# Altium schematic sheet M_microcontrolador.SchDoc
size Legal
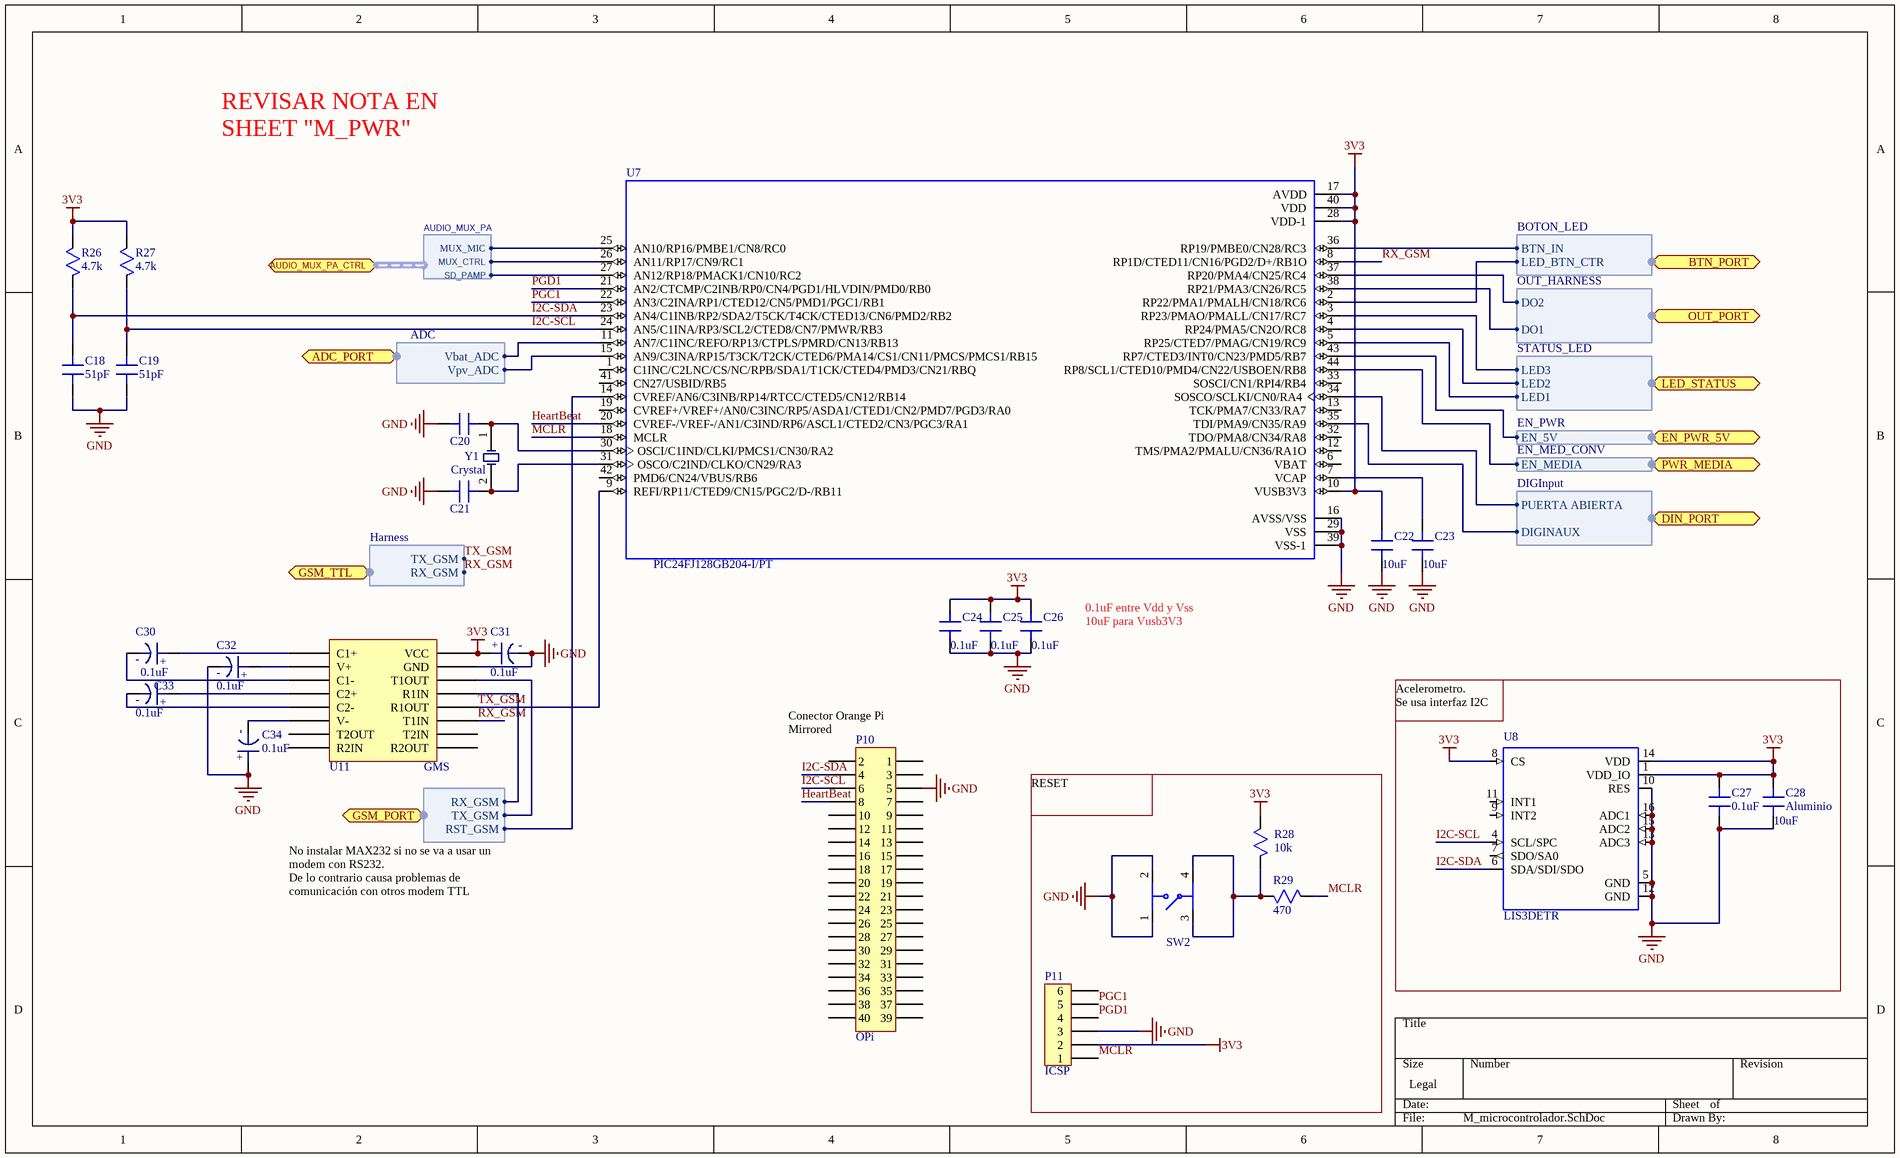
[diagram p0: M_microcontrolador.SchDoc]

## Parts
C18  51pF  [Capacitor0805]
C19  51pF  [Capacitor0805]
C20  CapacitorSMD  [Capacitor0805]  (value not drawn)
C21  CapacitorSMD  [Capacitor0805]  (value not drawn)
C22  value 10uF  [Capacitor0805]  (hidden comment: CapacitorSMD)
C23  value 10uF  [Capacitor0805]  (hidden comment: CapacitorSMD)
C24  value 0.1uF  [Capacitor0805]  (hidden comment: CapacitorSMD)
C25  value 0.1uF  [Capacitor0805]  (hidden comment: CapacitorSMD)
C26  value 0.1uF  [Capacitor0805]  (hidden comment: CapacitorSMD)
C27  value 0.1uF  [Capacitor0805]  (hidden comment: CapacitorSMD)
C28  Aluminio  value 10uF  [Capacitor0805]
C30  0.1uF  [CAPACITORE0805]
C31  0.1uF  [CAPACITORE0805]
C32  0.1uF  [CAPACITORE0805]
C33  0.1uF  [CAPACITORE0805]
C34  0.1uF  [CAPACITORE0805]
P10  OPi  [MALE2x20PIN]
P11  ICSP  [MALE6PIN]
R26  4.7k  [ResistorSMD0805]
R27  4.7k  [ResistorSMD0805]
R28  10k  [ResistorSMD0805]
R29  470  [ResistorSMD1206]
SW2  Tactile Switch  [TactileSwitch]  (value not drawn)
U7  PIC24FJ128GB204-I/PT  [QFP80P1200X1200X120-44N]
U8  LIS3DETR  [LGA16R50P5X3_300X300X100N]
U11  SP3232EBCN  [SP3232EBCN]  (value not drawn)
Y1  Crystal  [CRYSTALSMDMini]

## Ports
ADC_PORT (harness ADC), AUDIO_MUX_PA_CTRL (harness AUDIO_MUX_PA), BTN_PORT (harness BOTON_LED), DIN_PORT (harness DIGInput), EN_PWR_5V (harness EN_PWR), GSM_PORT (harness GMS), GSM_TTL (harness Harness), LED_STATUS (harness STATUS_LED), OUT_PORT (harness OUT_HARNESS), PWR_MEDIA (harness EN_MED_CONV)

## Harnesses
ADC: Vbat_ADC, Vpv_ADC
STATUS_LED: LED1, LED2, LED3
BOTON_LED: BTN_IN, LED_BTN_CTR
OUT_HARNESS: DO1, DO2
DIGInput: PUERTA ABIERTA, DIGINAUX
EN_PWR: EN_5V
EN_MED_CONV: EN_MEDIA
AUDIO_MUX_PA: SD_PAMP, MUX_CTRL, MUX_MIC
GMS: RST_GSM, RX_GSM, TX_GSM
Harness: RX_GSM, TX_GSM

## Nets
3V3: C22.2 C24.2 C25.2 C26.2 C27.2 C28.2 C31.1 P11.2 R26.2 R27.2 R28.2 U7.10(VUSB3V3) U7.17(AVDD) U7.28(VDD-1) U7.40(VDD) U8.1(VDD_IO) U8.8(CS) U8.14(VDD) U11.16(VCC)
GND: C18.2 C19.2 C20.1 C21.1 C22.1 C23.1 C24.1 C25.1 C26.1 C27.1 C28.1 C31.2 C32.2 C34.1 P10.5 P11.3 SW2.1 SW2.2 U7.16(AVSS/VSS) U7.29(VSS) U7.39(VSS-1) U8.5(GND) U8.10(RES) U8.12(GND) U8.13(ADC3) U8.15(ADC2) U8.16(ADC1) U11.15(GND)
HeartBeat: P10.8 U7.20(CVREF-/VREF-/AN1/C3IND/RP6/ASCL1/CTED2/CN3/PGC3/RA1)
I2C-SCL: C19.1 P10.6 R27.1 U7.24(AN5/C1INA/RP3/SCL2/CTED8/CN7/PMWR/RB3) U8.4(SCL/SPC)
I2C-SDA: C18.1 P10.4 R26.1 U7.23(AN4/C1INB/RP2/SDA2/T5CK/T4CK/CTED13/CN6/PMD2/RB2) U8.6(SDA/SDI/SDO)
MCLR: P11.1 R29.2 U7.18(MCLR)
PGC1: P11.5 U7.22(AN3/C2INA/RP1/CTED12/CN5/PMD1/PGC1/RB1)
PGD1: P11.4 U7.21(AN2/CTCMP/C2INB/RP0/CN4/PGD1/HLVDIN/PMD0/RB0)
RX_GSM: U7.8(RP1D/CTED11/CN16/PGD2/D+/RB1O) U11.11(T1IN) ; port GSM_TTL.RX_GSM
TX_GSM: U7.9(REFI/RP11/CTED9/CN15/PGC2/D-/RB11) U11.12(R1OUT) ; port GSM_TTL.TX_GSM
NetC20_2: C20.2 U7.30(OSCI/C1IND/CLKI/PMCS1/CN30/RA2) Y1.1
NetC21_2: C21.2 U7.31(OSCO/C2IND/CLKO/CN29/RA3) Y1.2
NetC23_2: C23.2 U7.7(VCAP)
NetC30_1: C30.1 U11.1(C1+)
NetC30_2: C30.2 U11.3(C1-)
NetC32_1: C32.1 U11.2(V+)
NetC33_1: C33.1 U11.4(C2+)
NetC33_2: C33.2 U11.5(C2-)
NetC34_2: C34.2 U11.6(V-)
NetR28_1: R28.1 R29.1 SW2.3 SW2.4
NetU7_2: U7.2(RP22/PMA1/PMALH/CN18/RC6) ; port BTN_PORT.LED_BTN_CTR
NetU7_3: U7.3(RP23/PMAO/PMALL/CN17/RC7) ; port LED_STATUS.LED3
NetU7_4: U7.4(RP24/PMA5/CN2O/RC8) ; port LED_STATUS.LED2
NetU7_5: U7.5(RP25/CTED7/PMAG/CN19/RC9) ; port LED_STATUS.LED1
NetU7_11: U7.11(AN7/C1INC/REFO/RP13/CTPLS/PMRD/CN13/RB13) ; port ADC_PORT.Vbat_ADC
NetU7_14: U7.14(CVREF/AN6/C3INB/RP14/RTCC/CTED5/CN12/RB14) ; port GSM_PORT.RST_GSM
NetU7_15: U7.15(AN9/C3INA/RP15/T3CK/T2CK/CTED6/PMA14/CS1/CN11/PMCS/PMCS1/RB15) ; port ADC_PORT.Vpv_ADC
NetU7_25: U7.25(AN10/RP16/PMBE1/CN8/RC0) ; port AUDIO_MUX_PA_CTRL.MUX_MIC
NetU7_26: U7.26(AN11/RP17/CN9/RC1) ; port AUDIO_MUX_PA_CTRL.MUX_CTRL
NetU7_27: U7.27(AN12/RP18/PMACK1/CN10/RC2) ; port AUDIO_MUX_PA_CTRL.SD_PAMP
NetU7_34: U7.34(SOSCO/SCLKI/CN0/RA4) ; port DIN_PORT.PUERTA ABIERTA
NetU7_35: U7.35(TDI/PMA9/CN35/RA9) ; port DIN_PORT.DIGINAUX
NetU7_36: U7.36(RP19/PMBE0/CN28/RC3) ; port BTN_PORT.BTN_IN
NetU7_37: U7.37(RP20/PMA4/CN25/RC4) ; port OUT_PORT.DO2
NetU7_38: U7.38(RP21/PMA3/CN26/RC5) ; port OUT_PORT.DO1
NetU7_43: U7.43(RP7/CTED3/INT0/CN23/PMD5/RB7) ; port EN_PWR_5V.EN_5V
NetU7_44: U7.44(RP8/SCL1/CTED10/PMD4/CN22/USBOEN/RB8) ; port PWR_MEDIA.EN_MEDIA
NetU11_13: U11.13(R1IN) ; port GSM_PORT.RX_GSM
NetU11_14: U11.14(T1OUT) ; port GSM_PORT.TX_GSM

Not connected (* = marked no-connect by the designer): P10 1 2 3 7 9 10 11 12 13 14 15 16 17 18 19 20 21 22 23 24 25 26 27 28 29 30 31 32 33 34 35 36 37 38 39 40; P11 6; U7 1(C1INC/C2LNC/CS/NC/RPB/SDA1/T1CK/CTED4/PMD3/CN21/RBQ) 6(VBAT) 12(TMS/PMA2/PMALU/CN36/RA1O) 13(TCK/PMA7/CN33/RA7) 19(CVREF+/VREF+/AN0/C3INC/RP5/ASDA1/CTED1/CN2/PMD7/PGD3/RA0) 32(TDO/PMA8/CN34/RA8) 33(SOSCI/CN1/RPI4/RB4) 41(CN27/USBID/RB5) 42(PMD6/CN24/VBUS/RB6); U8 7(SDO/SA0) 9(INT2) 11(INT1); U11 7(T2OUT) 8(R2IN) 9(R2OUT) 10(T2IN)

## Notes on the sheet
- REVISAR NOTA EN SHEET "M_PWR"
- 0.1uF entre Vdd y Vss
  10uF para Vusb3V3
- (near P10) Conector Orange Pi
  Mirrored
- (near U8) Acelerometro.
  Se usa interfaz I2C
- RESET
- No instalar MAX232 si no se va a usar un modem con RS232.
  De lo contrario causa problemas de comunicación con otros modem TTL
- (in symbol CapacitorESMD) -; +

## Library data of the parts
C18 C19 = CapacitorSMD: Ceramic Capacitor; PartNo: CL21C510JBANNNC; Manufacturer Name: Samsung Electro-Mechanics; PartDescription: CAP CER 51PF 50V C0G/NP0 0805; Type: Surface Mount; Digi-Key Part Number: 1276-2670-1-ND; Value: 51pF; Package: 0805; Distributors Part Number: 1276-2670-1-ND; Manufacturers Part Number: CL21C510JBANNNC
C20 C21 = CapacitorSMD: Ceramic Capacitor; PartNo: 08051A6R0CAT2A; Manufacturer Name: AVX Corporation; PartDescription: CAP CER 6PF 100V NP0 0805; Value: 6pF; Type: Surface Mount; Digi-Key Part Number: 478-10411-1-ND; Package: 0805; Distributors Part Number: 478-10411-1-ND; Manufacturers Part Number: 08051A6R0CAT2A
C22 C23 C28 = CapacitorSMD: Ceramic Capacitor; PartNo: CC0805ZKY5V6BB106; Manufacturer Name: Yageo; PartDescription: CAP CER 10UF 10V Y5V 0805; Type: Surface Mount; Digi-Key Part Number: 311-1355-1-ND; Package: 0805; Distributors Part Number: 311-1355-1-ND; Manufacturers Part Number: CC0805ZKY5V6BB106
C24-C27 = CapacitorSMD: Ceramic Capacitor; PartNo: CC0805KRX7R8BB104; Manufacturer Name: Yageo; PartDescription: CAP CER 0.1UF 25V X7R 0805; Type: Surface Mount; Digi-Key Part Number: 311-1141-1-ND; Distributors Part Number: 311-1141-1-ND; Manufacturers Part Number: CC0805KRX7R8BB104
  C24: package: 0805
  C25-C27: Package: 0805
C30-C34 = CapacitorESMD: Electrolitic Capacitor; PartNo: CC0805KRX7R8BB104; Manufacturer Name: Yageo; PartDescription: CAP CER 0.1UF 25V X7R 0805; Type: Surface Mount; Digi-Key Part Number: 311-1141-1-ND; Value: 0.1uF; Package: 0805; Distributors Part Number: 311-1141-1-ND; Manufacturers Part Number: CC0805KRX7R8BB104
P10 = PHM2x20P2.54: Pin Header Male 40 Pins Pitch 2.54mm; PartNo: CONN HDR 40POS 0.1 GOLD PCB; Manufacturer Name: Sullins Connector Solutions; Digi-Key Part Number: S7123-ND; Package: Connector 0.100" (2.54mm) Through Hole; Distributors Part Number: S7123-ND; Manufacturers Part Number: CONN HDR 40POS 0.1 GOLD PCB; PartDescription: CONN HDR 40POS 0.1 GOLD PCB; Type: Through Hole
P11 = PHM1x6P2.54: Pin Header Male 6 Pins Pitch 2.54mm; PartNo: CONN HEADER R/A 6POS 2.54MM; Manufacturer Name: Harwin Inc.; Digi-Key Part Number: 952-2247-ND; Package: 0.100" (2.54mm); Distributors Part Number: 952-2247-ND; Manufacturers Part Number: CONN HEADER R/A 6POS 2.54MM; PartDescription: CONN HEADER R/A 6POS 2.54MM; Type: Through Hole
R26 R27 = ResistorSMD: Chip Resistor SMD; Manufacturer Name: Panasonic Electronic Components; Manufacturers Part Number: ERJ-6GEYJ472V; PartDescription: RES SMD 4.7K OHM 5% 1/8W 0805; Digi-Key Part Number: P4.7KACT-ND; Value: 4.7K; Distributors Part Number: P4.7KACT-ND; Package: 0805 (2012 Metric); PartNo: ERJ-6GEYJ472V; Type: Surface Mount
R28 = ResistorSMD: Chip Resistor SMD; Manufacturer Name: Yageo; Manufacturers Part Number: RC0805JR-0710KL; PartDescription: RES SMD 10K OHM 5% 1/8W 0805; Digi-Key Part Number: 311-10KARCT-ND; Value: 10k; Distributors Part Number: 311-10KARCT-ND; Package: 0805; PartNo: RC0805JR-0710KL; Type: Surface Mount
R29 = ResistorSMD: Chip Resistor SMD; Manufacturer Name: Samsung Electro-Mechanics; Manufacturers Part Number: RC3216J471CS; PartDescription: RES SMD 470 OHM 5% 1/4W 1206; Value: 470R; Digi-Key Part Number: 1276-5903-1-ND; Distributors Part Number: 1276-5903-1-ND; Package: 1206 (3216 Metric); PartNo: RC3216J471CS; Type: Surface Mount
SW2 = Tactile Switch: Switch Contact; Manufacturer Name: C&K; Manufacturers Part Number: PTS645SM43SMTR92 LFS; PartDescription: SWITCH TACTILE SPST-NO 0.05A 12V; Digi-Key Part Number: CKN9112CT-ND; Distributors Part Number: CKN9112CT-ND; Package: 6.00mm x 6.00mm; PartNo: PTS645SM43SMTR92 LFS; Type: Surface Mount
U7 = PIC24FJ128GB204-I/PT: 128KB Flash, 8KB RAM, 16 MIPS, USB OTG, Crypto, 44 TQFP 10x10x1mm TRAY; Manufacturer Name: Microchip; PartDescription: IC MCU 16BIT 128KB FLASH 44TQFP; Package: 44-TQFP; Value: *; Digi-Key Part Number: PIC24FJ128GB204-I/PT-ND; Distributors Part Number: PIC24FJ128GB204-I/PT-ND; Manufacturers Part Number: PIC24FJ128GB204-I/PT; PartNo: PIC24FJ128GB204-I/PT; Type: Surface Mount
U8 = LIS3DETR: MEMS digital output motion sensor ultra low-power high performance 3-axes nano accelerometer; Manufacturer Name: STMicroelectronics; PartDescription: ACCEL 2-16G I2C/SPI 16LGA; Package: 16-VFLGA; Value: *; Digi-Key Part Number: 497-16262-1-ND; Distributors Part Number: 497-16262-1-ND; Manufacturers Part Number: LIS3DETR; PartNo: LIS3DETR; Type: Surface Mount
U11 = SP3232EBCN: Serial Adapter RS232; Manufacturer Name: MaxLinear, Inc.; Manufacturers Part Number: SP3232ECN-L/TR; PartDescription: IC TXRX RS232 ESD TRUE 16SOIC; Digi-Key Part Number: 1016-1803-1-ND; Distributors Part Number: 1016-1803-1-ND; Package: 16-SOIC (0.154", 3.90mm Width); PartNo: SP3232ECN-L/TR; Type: Surface Mount
Y1 = Crystal: Crystal SMD; Manufacturer Name: ECS Inc.; Manufacturers Part Number: ECS-240-8-30B-CKM; PartDescription: CRYSTAL 24.0000MHZ 8PF SMD; Value: 24MHz; Digi-Key Part Number: XC1842CT-ND; Distributors Part Number: XC1842CT-ND; Package: 4-SMD, No Lead; PartNo: ECS-240-8-30B-CKM; Type: Surface Mount